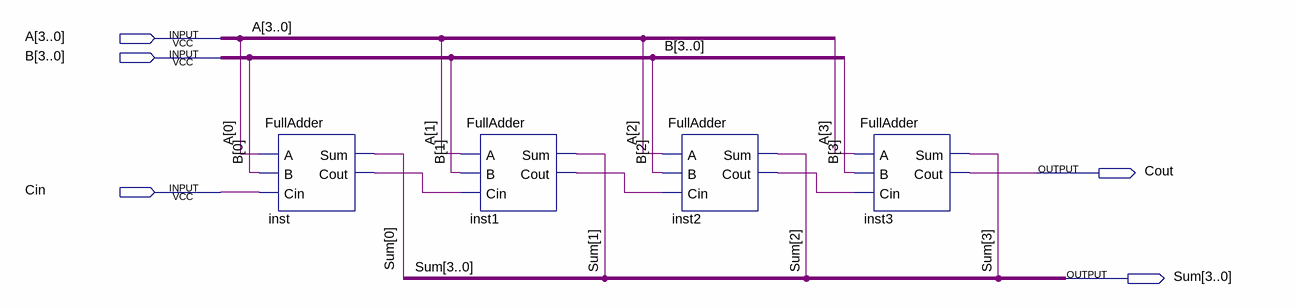
[diagram p0: schematic sheet]
// Quartus schematic FourBitFullAdder.bdf as structural Verilog: 4 symbols, 5 pins
module FourBitFullAdder (
  input  [3:0] A,
  input  [3:0] B,
  input  Cin,
  output Cout,
  output [3:0] Sum
);

  wire inst1_cout, inst2_cout, inst_cout;

  FullAdder inst (.A(A[0]), .B(B[0]), .Cin(Cin), .Sum(Sum[0]), .Cout(inst_cout));
  FullAdder inst1 (.A(A[1]), .B(B[1]), .Cin(inst_cout), .Sum(Sum[1]), .Cout(inst1_cout));
  FullAdder inst2 (.A(A[2]), .B(B[2]), .Cin(inst1_cout), .Sum(Sum[2]), .Cout(inst2_cout));
  FullAdder inst3 (.A(A[3]), .B(B[3]), .Cin(inst2_cout), .Sum(Sum[3]), .Cout(Cout));
endmodule
